# EAGLE design Ver.5 電源 (EAGLE 9.6.2)
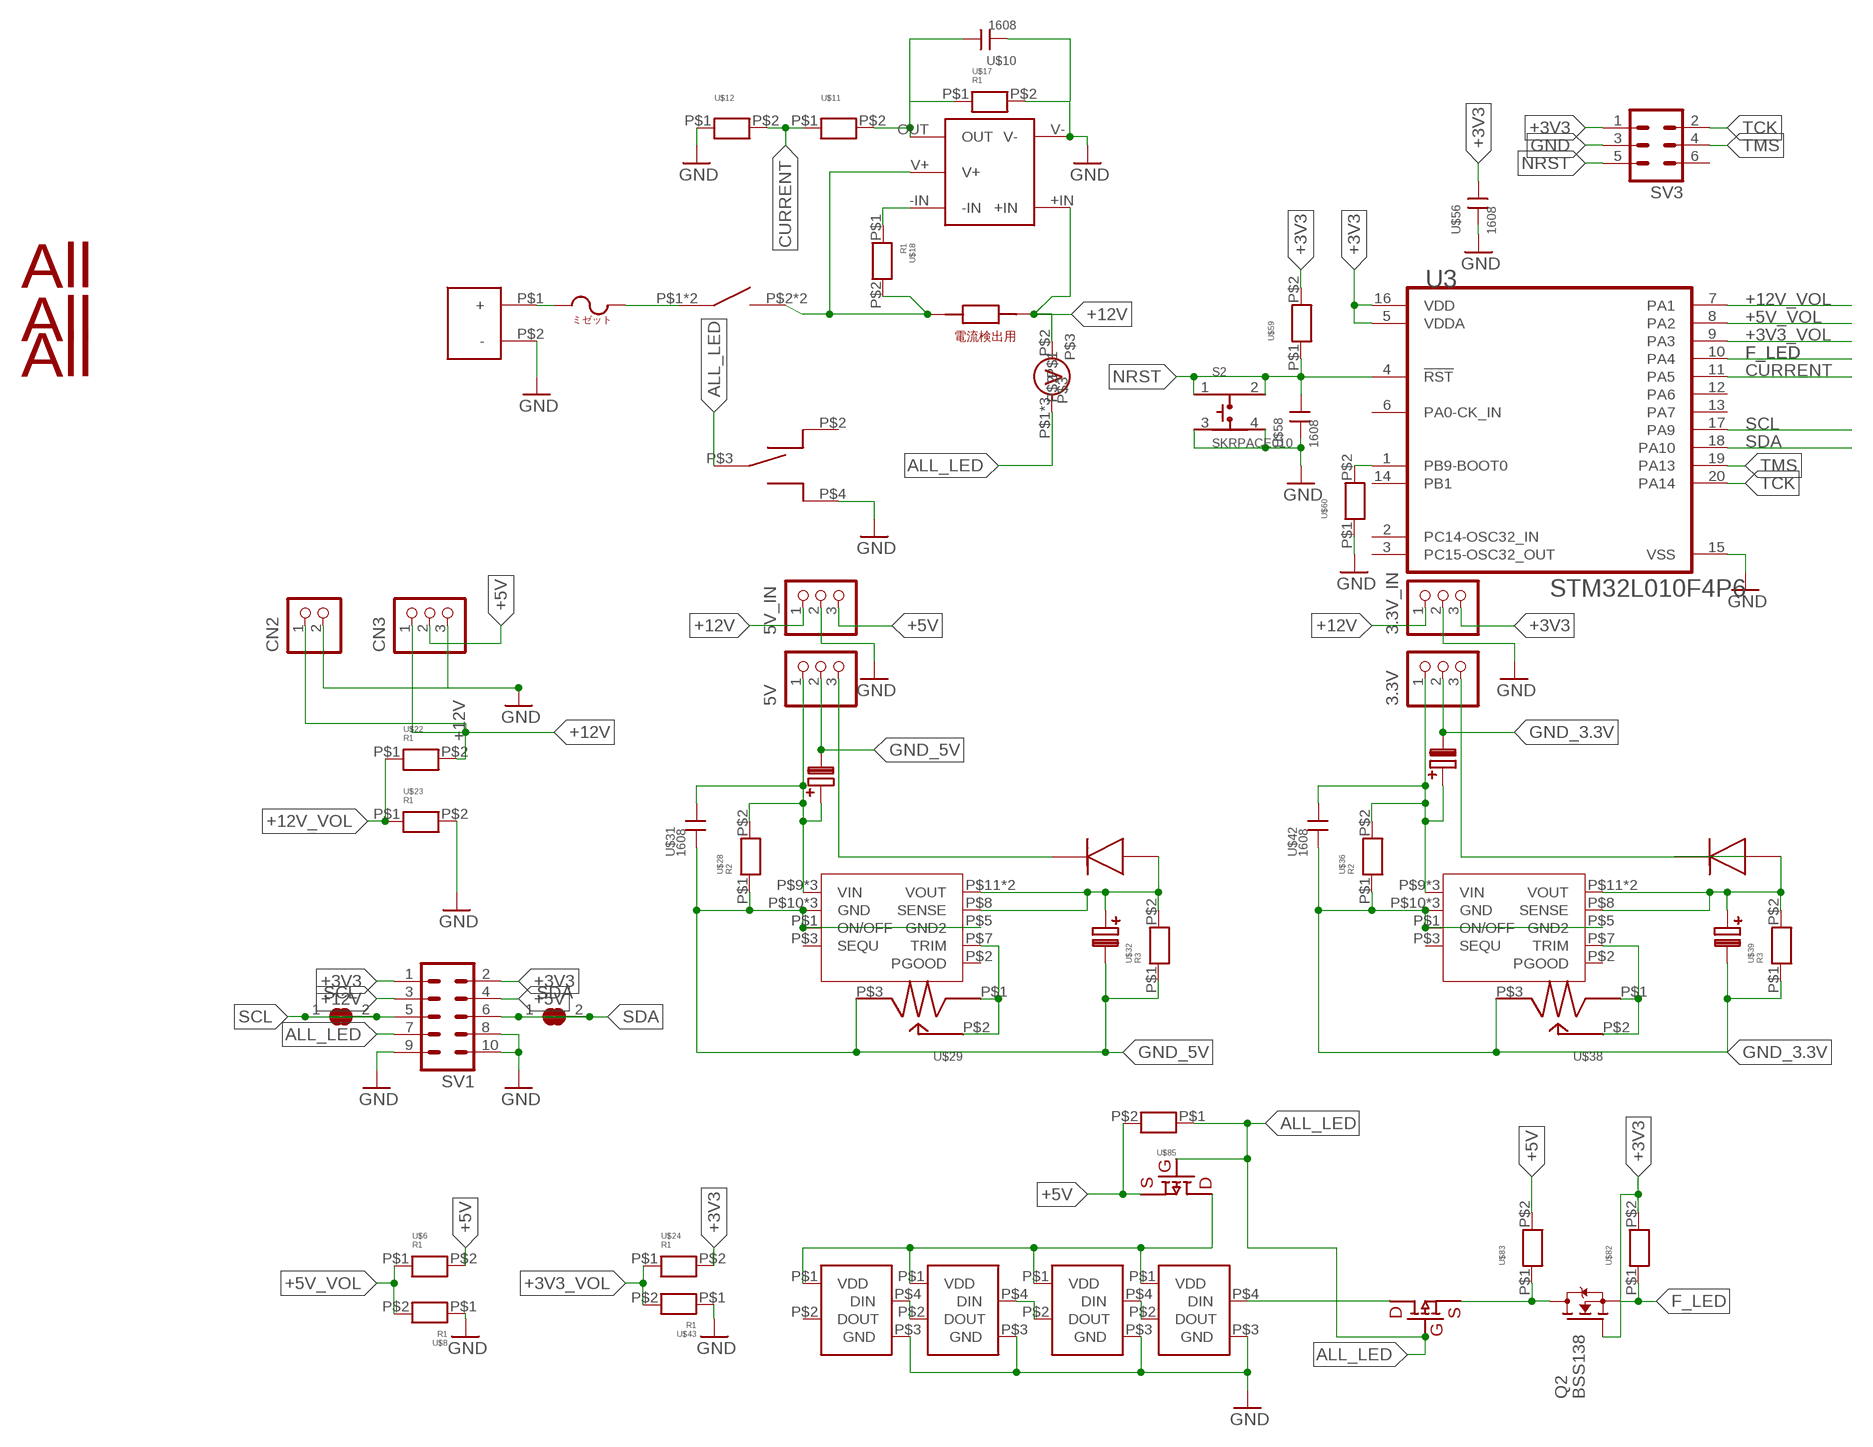
[diagram p0: schematic, sheet 1]

## Parts
3.3V  B3B-XH-A  [B3B-XH-A]
3.3V_IN  B3B-XH-A  [B3B-XH-A]
5V  B3B-XH-A  [B3B-XH-A]
5V_IN  B3B-XH-A  [B3B-XH-A]
CN2  B2B-XH-A  [B2B-XH-A]
CN3  B3B-XH-A  [B3B-XH-A]
F1  LED  [LED]
F2  LED  [LED]
F3  LED  [LED]
F18  LED  [LED]
Q2  BSS138  [SOT23]
S2  SKRPACE010  [SW_SKRPACE010]
SCL  SJ  [SJ]
SDA  SJ  [SJ]
SV1  ML10  [ML10]
SV3  ML6  [ML6]
U3  STMICROELECTRONICS_STM32L010F4P6STMICROELECTRONICS_STM32L010F4P6_0_0  [STMICROELECTRONICS_STM32L010F4P6_0]
U$1  XT60  [XT60]
U$2  MF  [ｍｆ]
U$3  V  [V]
U$4  SW3  [SW3]
U$5  25V100  [25V100]
U$6  R1  R  [1608]
U$7  25V100  [25V100]
U$8  R1  R  [1608]
U$9  ALL  [ALL]
U$10  1608  [CON]
U$11  R  [1608]
U$12  R  [1608]
U$13  LT6106  [LT6106]
U$14  R  [ｒ05]
U$15  ALL  [ALL]
U$16  S  [S]
U$17  R1  R  [1608]
U$18  R1  R  [1608]
U$19  ALL  [ALL]
U$22  R1  R  [1608]
U$23  R1  R  [1608]
U$24  R1  R  [1608]
U$26  DCDC  [DC-DC]
U$28  R2  R  [1608]
U$29  VR  [VR]
U$30  25V100  [25V100]
U$31  1608  [CON]
U$32  R3  R  [1608]
U$33  40V5A  [40V5A]
U$34  DCDC  [DC-DC]
U$36  R2  R  [1608]
U$37  40V5A  [40V5A]
U$38  VR  [VR]
U$39  R3  R  [1608]
U$40  25V100  [25V100]
U$42  1608  [CON]
U$43  R1  R  [1608]
U$56  1608  [CON]
U$58  1608  [CON]
U$59  R  [1608]
U$60  R  [1608]
U$82  R  [1608]
U$83  R  [1608]
U$84  808  [808]
U$85  R  [1608]
U$86  808  [808]

## Nets
+3V3: 3.3V_IN.3 Q2.1(G) SV1.1 SV1.2 SV3.1 U3.5(VDDA) U3.16(VDD) U$24.P$2 U$56.P$1 U$59.P$2 U$82.P$2
+3V3_VOL: U3.9(PA3) U$24.P$1 U$43.P$2
+5V: 5V_IN.3 CN3.2 SV1.4 U$6.P$2 U$83.P$2 U$84.S U$85.P$2
+5V_OFF1: F1.P$1(VDD) F2.P$1(VDD) F3.P$1(VDD) F18.P$1(VDD) U$84.D U$84.DD(D) U$84.DDD(D) U$84.DDDD(D)
+5V_VOL: U3.8(PA2) U$6.P$1 U$8.P$2
+12V: 3.3V_IN.1 5V_IN.1 CN2.1 CN3.1 SV1.3 U$3.P$2 U$13.+IN U$14.P$1 U$22.P$2
+12V_VOL: U3.7(PA1) U$22.P$1 U$23.P$1
ALL_LED: SV1.7 U$3.P$1 U$3.P$4 U$3.P$5 U$16.P$3 U$84.G U$85.P$1 U$86.G
CURRENT: U3.11(PA5) U$11.P$1 U$12.P$2
F_LED: Q2.2(S) U3.10(PA4) U$82.P$1
GND: 3.3V_IN.2 5V_IN.2 CN2.2 CN3.3 F1.P$3(GND) F2.P$3(GND) F3.P$3(GND) F18.P$3(GND) S2.3 S2.4 SV1.8 SV1.9 SV1.10 SV3.3 U3.15(VSS) U$1.P$2(-) U$8.P$1 U$10.P$2 U$12.P$1 U$13.V- U$16.P$4 U$17.P$2 U$23.P$2 U$43.P$1 U$56.P$2 U$58.P$2 U$60.P$1
GND_3.3V: 3.3V.2 U$7.P$2 U$34.P$1(ON/OFF) U$34.P$5(GND2) U$34.P$10(GND) U$34.P$16(GND) U$34.P$17(GND) U$36.P$1 U$38.P$3 U$39.P$1 U$40.P$2 U$42.P$2
GND_5V: 5V.2 U$5.P$2 U$26.P$1(ON/OFF) U$26.P$5(GND2) U$26.P$10(GND) U$26.P$16(GND) U$26.P$17(GND) U$28.P$1 U$29.P$3 U$30.P$2 U$31.P$2 U$32.P$1
N$1: U$10.P$1 U$11.P$2 U$13.OUT U$17.P$1
N$2: F2.P$2(DOUT) F3.P$4(DIN)
N$3: U$1.P$1(+) U$2.P$1 U$2.P$2
N$4: U$2.P$3 U$2.P$4 U$4.P$1 U$4.P$3
N$5: F1.P$2(DOUT) F2.P$4(DIN)
N$6: F1.P$4(DIN) F18.P$2(DOUT)
N$7: 5V.1 U$5.P$1 U$26.P$9(VIN) U$26.P$14(VIN) U$26.P$15(VIN) U$28.P$2 U$31.P$1
N$8: U$13.-IN U$18.P$1
N$9: 3.3V.1 U$7.P$1 U$34.P$9(VIN) U$34.P$14(VIN) U$34.P$15(VIN) U$36.P$2 U$42.P$1
N$10: 5V.3 U$33.P$2
N$11: U$4.P$2 U$4.P$4 U$13.V+ U$14.P$2 U$18.P$2
N$12: 3.3V.3 U$37.P$2
N$13: U3.1(PB9-BOOT0) U$60.P$2
N$15: U$26.P$8(SENSE) U$26.P$11(VOUT) U$26.P$18(VOUT) U$30.P$1 U$32.P$2 U$33.P$1
N$16: U$26.P$7(TRIM) U$29.P$1 U$29.P$2
N$21: U$34.P$8(SENSE) U$34.P$11(VOUT) U$34.P$18(VOUT) U$37.P$1 U$39.P$2 U$40.P$1
N$22: U$34.P$7(TRIM) U$38.P$1 U$38.P$2
N$35: Q2.3(D) U$83.P$1 U$86.S
N$36: F18.P$4(DIN) U$86.D U$86.DD(D) U$86.DDD(D) U$86.DDDD(D)
NRST: S2.1 S2.2 SV3.5 U3.4(!RST!) U$58.P$1 U$59.P$1
SCL: SCL.1 SCL.2 SV1.5 U3.17(PA9)
SDA: SDA.1 SDA.2 SV1.6 U3.18(PA10)
TCK: SV3.2 U3.20(PA14)
TMS: SV3.4 U3.19(PA13)
Unconnected: F3.P$2(DOUT) SV3.6 U3.2(PC14-OSC32_IN) U3.3(PC15-OSC32_OUT) U3.6(PA0-CK_IN) U3.12(PA6) U3.13(PA7) U3.14(PB1) U$3.P$3 U$16.P$2 U$26.P$2(PGOOD) U$26.P$3(SEQU) U$34.P$2(PGOOD) U$34.P$3(SEQU)

## Library data of the parts
3.3V 3.3V_IN 5V 5V_IN CN3 = jst-xh:B3B-XH-A: Wire-to-Board 2.5mm pitch top mount connector Source: http://www.jst-mfg.com/product/pdf/jpn/XH.pdf http://www.jst-mfg.com/product/detail.php?series=277
CN2 = jst-xh:B2B-XH-A: Wire-to-Board 2.5mm pitch top mount connector Source: http://www.jst-mfg.com/product/pdf/jpn/XH.pdf http://www.jst-mfg.com/product/detail.php?series=277
F1-F3 F18 = フルカラーLED:LED
Q2 = bss138_10:BSS138: BSS138 N-Channel Logic Level Enhancement Mode Field Effect Transistor Source: http://www.fairchildsemi.com/datasheets/BS/BSS138.pdf; MF: Fairchild; MPN: BSS138; OC_FARNELL: 9845330; OC_NEWARK: 67R2009
S2 = SKRPACE010:SKRPACE010: Switch Tactile N.O. SPST Button J-Bend 0.05A 16VDC 2.55N SMD Automotive T/R Check prices <https://pricing.snapeda.com/parts/SKRPACE010/ALPS/view-part?ref=eda>; AVAILABILITY: In Stock; DESCRIPTION: Switch Tactile N.O. SPST Button J-Bend 0.05A 16VDC 2.55N SMD Automotive T/R; MF: ALPS; MP: SKRPACE010; PACKAGE: None; PRICE: None
SCL SDA = jumper:SJ: SMD solder JUMPER
SV1 = con-ml:ML10: HARTING; OC_FARNELL: unknown; OC_NEWARK: unknown
SV3 = con-ml:ML6: HARTING; OC_FARNELL: unknown; OC_NEWARK: unknown
U3 = STMicroelectronics - STM32L010F4P6:STMICROELECTRONICS_STM32L010F4P6: ARM® Cortex®-M0+ STM32L0 Microcontroller IC 32-Bit 32MHz 16KB (16K x 8) FLASH 20-TSSOP; AMBIENT_TEMPERATURE_RANGE_HIGH: +85°C; AMBIENT_TEMPERATURE_RANGE_LOW: -40°C; AUTOMOTIVE: No; CENTROID_NOT_SPECIFIED: No; CORE_ARCHITECTURE: Arm Cortex-M0+; DATASHEET: https://www.st.com/resource/en/datasheet/stm32l010f4.pdf; DATA_BUS_WIDTH: 32bits; DEVICE_CLASS_L1: Integrated Circuits (ICs); DEVICE_CLASS_L2: Embedded Processors and Controllers; DEVICE_CLASS_L3: Microcontrollers; DIGIKEY_DESCRIPTION: IC 16/32-BITS MICROS; DIGIKEY_PART_NUMBER: 497-19364-ND; FOOTPRINT_PARAMETERS_1: {"fp_type":"TSSOP2","params":{"N":{"nom":20,"long name":"Number of leads","min":null,"max":null,"short name":"N","type":"count"},"A":{"nom":false,"long name":"Height","min":false,"max":1200000,"short name":"A","type":"measurement"},"A1":{"nom":false,"long name":"Package clearance","min":50000,"max":150000,"short name":"A1","type":"measurement"},"A2":{"nom":1000000,"long name":"Package height","min":800000,"max":1050000,"short name":"A2","type":"measurement"},"D":{"nom":6500000,"long name":"Package length","min":6400000,"max":6600000,"short name":"D","type":"measurement"},"E":{"nom":6400000,"long name":"Width /w leads","min":6200000,"max":6600000,"short name":"E","type":"measurement"},"E1":{"nom":4400000,"long name":"Package width","min":4300000,"max":4500000,"short name":"E1","type":"measurement"},"B":{"nom":false,"long name":"Lead width","min":190000,"max":300000,"short name":"B","type":"measurement"},"C":{"nom":false,"long name":"Lead thickness","min":90000,"max":200000,"short name":"C","type":"measurement"},"L":{"nom":600000,"long name":"Lead foot length","min":450000,"max":750000,"short name":"L","type":"measurement"},"e":{"nom":650000,"long name":"Lead pitch","min":null,"max":null,"short name":"e","type":"measurement"},"PHI":{"nom":false,"long name":"Lead angle","min":0,"max":8000000,"short name":"PHI","type":"measurement"},"HT":{"default":"No","long name":"Thermal pad","type":"multichoiceparent","short name":"HT","children":[]},"offset x":{"nom":0,"long name":"X Center offset","min":null,"max":null,"short name":"offset x","type":"measurement"},"offset y":{"nom":0,"long name":"Y Center offset","min":null,"max":null,"short name":"offset y","type":"measurement"},"LS":{"default":"Rounded rectangle","long name":"Land shape","type":"multichoice","short name":"LS"},"LS1":{"default":"Rectangle","long name":"Land shape (Pin 1)","type":"multichoice","short name":"LS1"},"solder toe":{"nom":550000,"long name":"Solder fillet (toe)","min":null,"max":null,"short name":"solder toe","type":"fixedmeasurement"},"solder heel":{"nom":450000,"long name":"Solder fillet (heel)","min":null,"max":null,"short name":"solder heel","type":"fixedmeasurement"},"solder side":{"nom":50000,"long name":"Solder fillet (side)","min":null,"max":null,"short name":"solder side","type":"fixedmeasurement"},"courtyard":{"nom":500000,"long name":"Courtyard","min":null,"max":null,"short name":"courtyard","type":"fixedmeasurement"},"SF":{"default":"A (> 0.625mm pitch)","long name":"Packing level","type":"multichoiceparent","short name":"SF","help":"http://support.upverter.com/customer/portal/articles/978783-what-is-a-footprint-packing-level","children":["solder toe","solder heel","solder side","courtyard"]}}}; FOOTPRINT_PARAMETERS_2: {"fp_type":"TSSOP2","params":{"N":{"nom":20,"long name":"Number of leads","min":null,"max":null,"short name":"N","type":"count"},"A":{"nom":false,"long name":"Height","min":false,"max":1200000,"short name":"A","type":"measurement"},"A1":{"nom":false,"long name":"Package clearance","min":50000,"max":150000,"short name":"A1","type":"measurement"},"A2":{"nom":1000000,"long name":"Package height","min":800000,"max":1050000,"short name":"A2","type":"measurement"},"D":{"nom":6500000,"long name":"Package length","min":6400000,"max":6600000,"short name":"D","type":"measurement"},"E":{"nom":6400000,"long name":"Width /w leads","min":6200000,"max":6600000,"short name":"E","type":"measurement"},"E1":{"nom":4400000,"long name":"Package width","min":4300000,"max":4500000,"short name":"E1","type":"measurement"},"B":{"nom":false,"long name":"Lead width","min":190000,"max":300000,"short name":"B","type":"measurement"},"C":{"nom":false,"long name":"Lead thickness","min":90000,"max":200000,"short name":"C","type":"measurement"},"L":{"nom":600000,"long name":"Lead foot length","min":450000,"max":750000,"short name":"L","type":"measurement"},"e":{"nom":650000,"long name":"Lead pitch","min":null,"max":null,"short name":"e","type":"measurement"},"PHI":{"nom":false,"long name":"Lead angle","min":0,"max":8000000,"short name":"PHI","type":"measurement"},"HT":{"default":"No","long name":"Thermal pad","type":"multichoiceparent","short name":"HT","children":[]},"offset x":{"nom":0,"long name":"X Center offset","min":null,"max":null,"short name":"offset x","type":"measurement"},"offset y":{"nom":0,"long name":"Y Center offset","min":null,"max":null,"short name":"offset y","type":"measurement"},"LS":{"default":"Rounded rectangle","long name":"Land shape","type":"multichoice","short name":"LS"},"LS1":{"default":"Rectangle","long name":"Land shape (Pin 1)","type":"multichoice","short name":"LS1"},"solder toe":{"nom":350000,"long name":"Solder fillet (toe)","min":null,"max":null,"short name":"solder toe","type":"fixedmeasurement"},"solder heel":{"nom":350000,"long name":"Solder fillet (heel)","min":null,"max":null,"short name":"solder heel","type":"fixedmeasurement"},"solder side":{"nom":30000,"long name":"Solder fillet (side)","min":null,"max":null,"short name":"solder side","type":"fixedmeasurement"},"courtyard":{"nom":250000,"long name":"Courtyard","min":null,"max":null,"short name":"courtyard","type":"fixedmeasurement"},"SF":{"default":"B (> 0.625mm pitch)","long name":"Packing level","type":"multichoiceparent","short name":"SF","help":"http://support.upverter.com/customer/portal/articles/978783-what-is-a-footprint-packing-level","children":["solder toe","solder heel","solder side","courtyard"]}}}; FOOTPRINT_PARAMETERS_3: {"fp_type":"TSSOP2","params":{"N":{"nom":20,"long name":"Number of leads","min":null,"max":null,"short name":"N","type":"count"},"A":{"nom":false,"long name":"Height","min":false,"max":1200000,"short name":"A","type":"measurement"},"A1":{"nom":false,"long name":"Package clearance","min":50000,"max":150000,"short name":"A1","type":"measurement"},"A2":{"nom":1000000,"long name":"Package height","min":800000,"max":1050000,"short name":"A2","type":"measurement"},"D":{"nom":6500000,"long name":"Package length","min":6400000,"max":6600000,"short name":"D","type":"measurement"},"E":{"nom":6400000,"long name":"Width /w leads","min":6200000,"max":6600000,"short name":"E","type":"measurement"},"E1":{"nom":4400000,"long name":"Package width","min":4300000,"max":4500000,"short name":"E1","type":"measurement"},"B":{"nom":false,"long name":"Lead width","min":190000,"max":300000,"short name":"B","type":"measurement"},"C":{"nom":false,"long name":"Lead thickness","min":90000,"max":200000,"short name":"C","type":"measurement"},"L":{"nom":600000,"long name":"Lead foot length","min":450000,"max":750000,"short name":"L","type":"measurement"},"e":{"nom":650000,"long name":"Lead pitch","min":null,"max":null,"short name":"e","type":"measurement"},"PHI":{"nom":false,"long name":"Lead angle","min":0,"max":8000000,"short name":"PHI","type":"measurement"},"HT":{"default":"No","long name":"Thermal pad","type":"multichoiceparent","short name":"HT","children":[]},"offset x":{"nom":0,"long name":"X Center offset","min":null,"max":null,"short name":"offset x","type":"measurement"},"offset y":{"nom":0,"long name":"Y Center offset","min":null,"max":null,"short name":"offset y","type":"measurement"},"LS":{"default":"Rounded rectangle","long name":"Land shape","type":"multichoice","short name":"LS"},"LS1":{"default":"Rectangle","long name":"Land shape (Pin 1)","type":"multichoice","short name":"LS1"},"solder toe":{"nom":150000,"long name":"Solder fillet (toe)","min":null,"max":null,"short name":"solder toe","type":"fixedmeasurement"},"solder heel":{"nom":250000,"long name":"Solder fillet (heel)","min":null,"max":null,"short name":"solder heel","type":"fixedmeasurement"},"solder side":{"nom":10000,"long name":"Solder fillet (side)","min":null,"max":null,"short name":"solder side","type":"fixedmeasurement"},"courtyard":{"nom":100000,"long name":"Courtyard","min":null,"max":null,"short name":"courtyard","type":"fixedmeasurement"},"SF":{"default":"C (> 0.625mm pitch)","long name":"Packing level","type":"multichoiceparent","short name":"SF","help":"http://support.upverter.com/customer/portal/articles/978783-what-is-a-footprint-packing-level","children":["solder toe","solder heel","solder side","courtyard"]}}}; FOOTPRINT_VARIANT_NAME_0: Recommended_Land_Pattern; FOOTPRINT_VARIANT_NAME_1: IPC_A; FOOTPRINT_VARIANT_NAME_2: IPC_B; FOOTPRINT_VARIANT_NAME_3: IPC_C; FREQUENCY: 32MHz; HEIGHT: 1.2mm; INTERFACE: I2C,SPI,UART,USART,SMBus,Other; IPC_LAND_PATTERN_NAME: SOP65P640X120-20; LEAD_FREE: Yes; MAX_JUNCTION_TEMP: +105°C; MAX_SUPPLY_VOLTAGE: 3.6V; MEMORY_SIZE: 16KBytes; MEMORY_TYPE: FLASH; MF: STMicroelectronics; MFG_PACKAGE_IDENT: TSSOP20-YA; MFG_PACKAGE_IDENT_DATE: 0; MFG_PACKAGE_IDENT_REV: 3; MIN_SUPPLY_VOLTAGE: 1.8V; MOUSER_DESCRIPTION: Cortex M0+ 16K TSSOP20 85°C; MOUSER_PART_NUMBER: 511-STM32L010F4P6; MPN: STM32L010F4P6; NUMBER_OF_A/D_CONVERTERS: 1; NUMBER_OF_ADC_CHANNELS: 7; NUMBER_OF_CORES: 1; NUMBER_OF_I/OS: 16; NUMBER_OF_I2C_CHANNELS: 1; NUMBER_OF_SPI_CHANNELS: 1; NUMBER_OF_TIMERS/COUNTERS: 7; NUMBER_OF_UART_CHANNELS: 1; PACKAGE: TSSOP20; PREFIX: U; RAM_SIZE: 2KBytes; ROHS: Yes; STANDOFF_HEIGHT: 0.05mm; TEMPERATURE_RANGE_HIGH: +105°C; TEMPERATURE_RANGE_LOW: -40°C; VERIFICATION_VERSION: 0.0.0.3
U$1 = XT60:XT60
U$2 = ミゼットヒューズ:MF
U$3 = voltmeter:V
U$4 = SW3:SW3
U$5 U$7 U$30 U$40 = 100uF25V 電解:25V100
U$6 U$8 U$11 U$12 U$17 U$18 U$22-U$24 U$28 U$32 U$36 U$39 U$43 U$59 U$60 U$82 U$83 U$85 = R 1608:R
U$9 U$15 U$19 = All_outlook:ALL
U$10 U$31 U$42 U$56 U$58 = con1608:1608
U$13 = LT6106:LT6106
U$14 = R 1W0.1Ω:R
U$16 = トグル:S
U$26 U$34 = OKL:DCDC
U$29 U$38 = VR tippu:VR
U$33 U$37 = D40V5A:40V5A
U$84 U$86 = PchMOSFET SSM6J808R:808

## Board
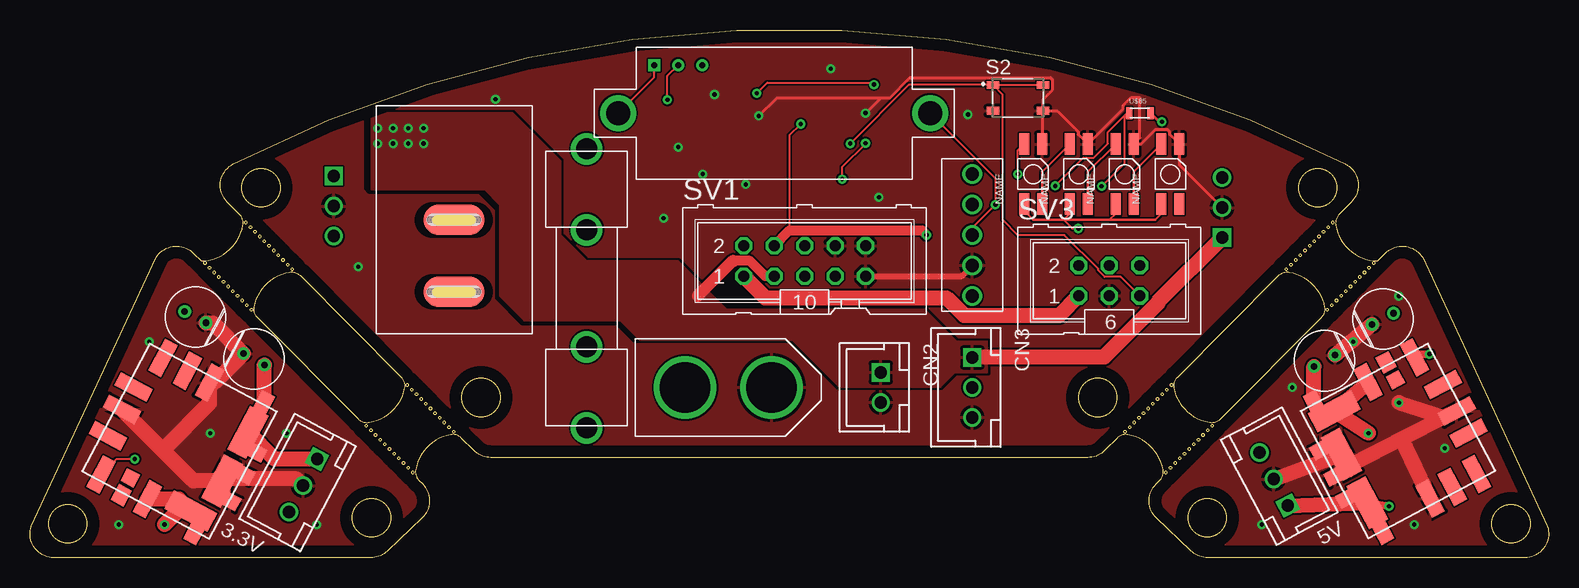
[diagram p1: board, top side]
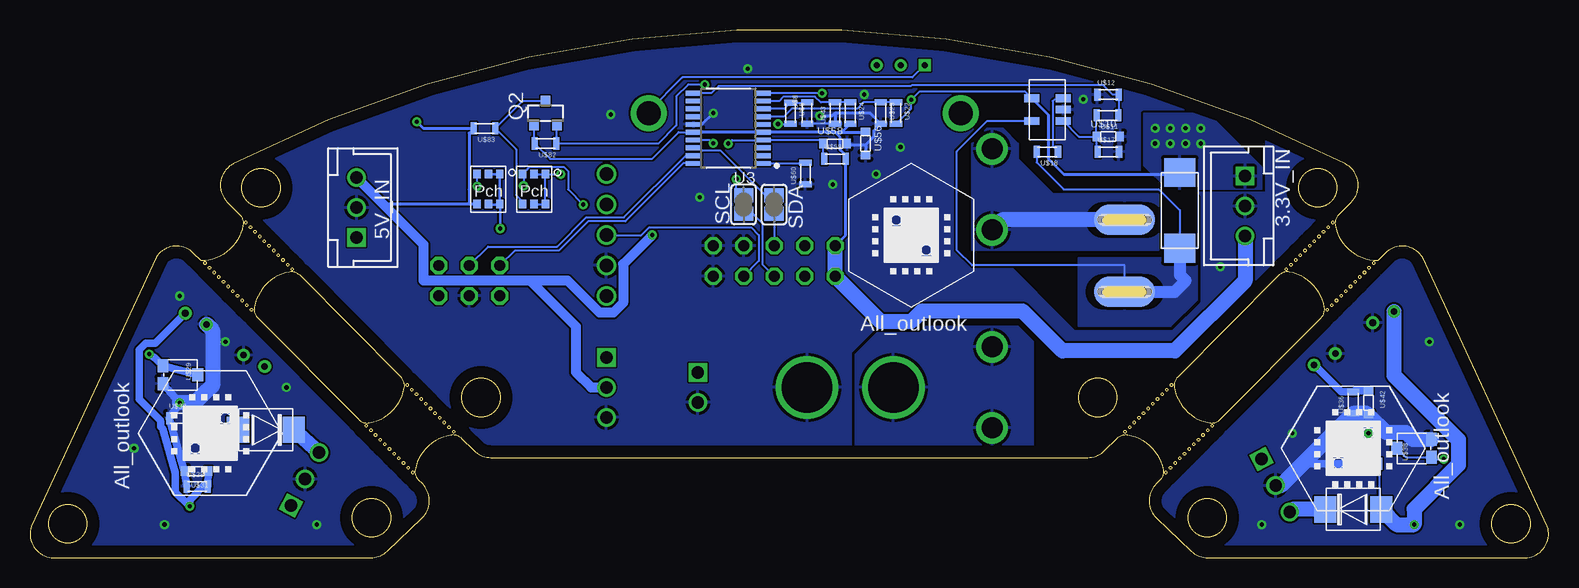
[diagram p2: board, bottom side, seen from below]

Size 126.55 x 43.97 mm. Coordinates in mm from the lower left corner, seen from the top.
Outline: 98.3,11.24 arc-70 95.36,14.15 arc-55 95.63,15.04 104.05,23.52 arc-55 104.93,23.8 arc-70 107.87,20.88 arc-55 107.6,20 99.18,11.52 arc-55 98.3,11.24
Outline: 38.41,8.34 arc-45 36.99,8.93 35.96,9.97 arc55 35.07,10.25 arc70 32.13,7.33 arc55 32.41,6.45 32.71,6.14 arc-90 32.7,3.32 29.78,0.55 arc-43 28.4,0 1.99,0 arc-107 0.1,2.62 10.51,25.02 arc-103 13.62,25.37 14.26,24.73 arc78 17.75,27.7 arc55 17.48,28.59 16.44,29.63 arc-107 16.94,32.81 arc-55 109.61,32.81 arc-107 110.11,29.63 109.08,28.59 arc55 108.81,27.7 arc78 112.3,24.73 112.93,25.37 arc-103 116.05,25.02 126.46,2.62 arc-107 124.57,0 98.15,0 arc-43 96.78,0.55 93.86,3.32 arc-90 93.85,6.14 94.15,6.45 arc55 94.42,7.33 arc70 91.48,10.25 arc55 90.6,9.97 89.57,8.93 arc-45 88.15,8.34 38.41,8.34
Outline: 18.68,20.88 arc-70 21.62,23.8 arc-55 22.51,23.52 30.92,15.04 arc-55 31.2,14.15 arc-70 28.26,11.24 arc-55 27.38,11.52 18.96,20 arc-55 18.68,20.88
Outline: circle at 92.8,12.04 radius 0.1
Outline: circle at 98.14,10.61 radius 0.1
Outline: circle at 95.04,7.49 radius 0.1
Outline: circle at 93.19,12.43 radius 0.1
Outline: circle at 97.75,10.22 radius 0.1
Outline: circle at 105.08,24.42 radius 0.1
Outline: circle at 108.49,21.04 radius 0.1
Outline: circle at 111.59,24.16 radius 0.1
Outline: circle at 106.25,25.59 radius 0.1
Outline: circle at 96.59,9.05 radius 0.1
Outline: circle at 95.82,8.27 radius 0.1
Outline: circle at 104.7,24.03 radius 0.1
Outline: circle at 107.8,27.15 radius 0.1
Outline: circle at 107.3,30.82 radius 1.6
Outline: circle at 108.57,27.93 radius 0.1
Outline: circle at 93.96,13.21 radius 0.1
Outline: circle at 98.09,3.34 radius 1.6
Outline: circle at 94.65,7.1 radius 0.1
Outline: circle at 108.18,27.54 radius 0.1
Outline: circle at 88.97,13.34 radius 1.6
Copper layers (1*16): Top 0.035mm / dielectric 1.5mm / Bottom 0.035mm
Design rules "default": minimum track width 6mil, minimum drill 0.35mm, track to track 6mil, track to pad 6mil, pad to pad 6mil, via to via 6mil, smd to smd 6mil, copper to edge 40mil, drill to drill 6mil, minimum pad ring 10mil, minimum via ring 8mil, stop-mask expansion 4mil, vias tented up to drill 0mil, thermal gap 10mil
Holes 0.9 mm at 33.8,22.15 36.86,22.15 35.07,22.15 36.34,22.15 33.93,22.15 34.05,22.15 34.18,22.15 34.31,22.15 34.44,22.15 34.56,22.15 34.56,22.15 34.69,22.15 34.82,22.15 34.94,22.15 35.2,22.15 35.32,22.15 35.45,22.15 35.58,22.15 35.71,22.15 36.86,22.15 36.73,22.15 36.61,22.15 36.48,22.15 36.23,22.15 36.1,22.15 35.97,22.15 35.85,22.15 35.85,22.15 33.67,22.15 33.55,22.15 36.99,22.15 37.12,22.15 33.8,28.14 36.86,28.14 35.07,28.14 36.34,28.14 33.93,28.14 34.05,28.14 34.18,28.14 34.31,28.14 34.44,28.14 34.56,28.14 34.56,28.14 34.69,28.14 34.82,28.14 34.94,28.14 35.2,28.14 35.32,28.14 35.45,28.14 35.58,28.14 35.71,28.14 36.86,28.14 36.73,28.14 36.61,28.14 36.48,28.14 36.23,28.14 36.1,28.14 35.97,28.14 35.85,28.14 35.85,28.14 33.67,28.14 33.55,28.14 36.99,28.14 37.12,28.14

### Footprints (pad centres in the part's own frame; a part is rotated, then mirrored left to right if it is on the bottom)
B3B-XH-A = drill 1.016 square: 1 -2.5,0 | drill 1.016: 2 0,0; 3 2.5,0
B2B-XH-A = drill 1.016 square: 1 -1.25,0 | drill 1.016: 2 1.25,0
LED = smd 1.8 x 0.82: P$1 -2.5,0.75; P$2 -2.5,-0.75; P$3 2.5,-0.75; P$4 2.5,0.75
SOT23 = smd 0.8 x 0.9: 1 -0.95,-1; 2 0.95,-1; 3 0,1
SW_SKRPACE010 = smd 1.05 x 0.65: 1 -2.075,1.075; 2 2.075,1.075; 3 -2.075,-1.075; 4 2.075,-1.075
SJ = smd 1.168 x 1.6: 1 -0.762,0; 2 0.762,0
ML10 = drill 0.914 octagon: 1 -5.08,-1.27; 2 -5.08,1.27; 3 -2.54,-1.27; 4 -2.54,1.27; 5 0,-1.27; 6 0,1.27; 7 2.54,-1.27; 8 2.54,1.27; 9 5.08,-1.27; 10 5.08,1.27
ML6 = drill 0.914 octagon: 1 -2.54,-1.27; 2 -2.54,1.27; 3 0,-1.27; 4 0,1.27; 5 2.54,-1.27; 6 2.54,1.27
STMICROELECTRONICS_STM32L010F4P6_0 = smd 1.35 x 0.4: 1 -2.875,2.925; 2 -2.875,2.275; 3 -2.875,1.625; 4 -2.875,0.975; 5 -2.875,0.325; 6 -2.875,-0.325; 7 -2.875,-0.975; 8 -2.875,-1.625; 9 -2.875,-2.275; 10 -2.875,-2.925; 11 2.875,-2.925; 12 2.875,-2.275; 13 2.875,-1.625; 14 2.875,-0.975; 15 2.875,-0.325; 16 2.875,0.325; 17 2.875,0.975; 18 2.875,1.625; 19 2.875,2.275; 20 2.875,2.925
XT60 = drill 4.2: P$1 -3.6,0; P$2 3.6,0
ｍｆ = drill 1.75: P$1 -6.55,0; P$2 0.2,0; P$3 9.96,0; P$4 16.71,0
V = drill 0.5 square: P$1 10,-4 | drill 0.5: P$2 8,-4; P$3 6,-4 | drill 2: P$4 -13,0; P$5 13,0
SW3 = smd 2.54 x 5.08: P$1 0,0; P$2 -6,0 | smd 2.54 x 5.08 bottom: P$3 0,0; P$4 -6,0
25V100 = drill 0.55: P$1 -1,0; P$2 1,0
1608 = smd 0.508 x 1.016: P$1 -0.889,0; P$2 0.889,0
CON = smd 0.6 x 0.813: P$1 -1,0; P$2 1,0
LT6106 = smd 0.635 x 1.27: +IN 0.95,1.31; -IN 0.95,-1.31; OUT -0.95,-1.31; V+ -0.95,1.31; V- 0,-1.31
ｒ05 = smd 2.4 x 2.6: P$1 0,1.55; P$2 6.3,1.55
S = drill 1.1: P$1 0,-5.08; P$2 0,-2.54; P$3 0,0; P$4 0,2.54; P$5 0,5.08
DC-DC = smd 3 x 1.2: P$1 -5.5,-0.1; P$2 -5.5,-2.19; P$3 -5.5,-4.48; P$7 5.5,-4.48; P$8 5.5,-0.1 | smd 1.2 x 3: P$4 -2.19,-5.5; P$5 -0.1,-5.5; P$6 2.39,-5.5 | smd 4.07 x 1.77: P$9 -3.335,4.685; P$10 1.245,4.685 | smd 1.77 x 4.07: P$11 4.685,3.535 | smd 1.5 x 1.2: P$12 6.25,-2.19 | smd 1.2 x 1.2: P$13 4.6,-2.19 | smd 1.63 x 1.2: P$14 -6.2,4.685; P$18 6.2,4.68 | smd 1.2 x 1.63: P$15 -2.19,6; P$16 -0.1,6; P$17 2.39,6
VR = smd 1.1 x 0.9: P$1 0,1.45; P$2 -0.75,-1.45; P$3 0.75,-1.45
40V5A = smd 1.85 x 2.2: P$1 -2.325,0; P$2 2.325,0
808 = smd 0.62 x 0.7: D 0,0; DD 0.95,0; DDD 0.95,2.5; DDDD 0,2.5; G 1.9,0; S 1.9,2.5

### Placement (x,y rotation side)
3.3V  22.75,6.01 242 top
3.3V_IN  25.3,29.3 270 bottom
5V  103.64,6.55 118 top
5V_IN  99.35,29.17 90 bottom
CN2  70.9,14.19 270 top
CN3  78.52,14.19 270 top
F1  87.41,31.97 90 top
F2  91.22,31.97 90 top
F3  95.03,31.97 90 top
F18  83.6,31.97 90 top
Q2  83.6,37.05 0 bottom
S2  82.33,38.32 0 top
SCL  67.09,29.43 90 bottom
SDA  64.55,29.43 270 bottom
SV1  64.55,24.73 0 top
SV3  89.95,23.08 0 top
U3  68.36,35.78 180 bottom
U$1  58.2,14.19 0 top
U$2  46.39,17.36 90 top
U$3  62.01,37.05 180 top
U$4  35.34,28.16 90 top
U$5  112.73,19.9 208 top
U$6  63.18,37.03 270 bottom
U$7  18.66,16.54 152 top
U$8  61.79,37.05 90 bottom
U$9  53.12,26.89 0 bottom
U$10  36.7,35.09 0 bottom
U$11  36.76,36.86 180 bottom
U$12  36.71,38.58 0 bottom
U$13  41.76,37.34 90 bottom
U$14  32.29,32.09 270 bottom
U$15  16.29,9.11 90 bottom
U$16  78.52,26.89 180 top
U$17  36.7,33.82 0 bottom
U$18  41.78,33.82 180 bottom
U$19  111.54,10.38 270 bottom
U$22  54.39,37.05 270 bottom
U$23  55.66,37.05 270 bottom
U$24  58.2,37.05 270 bottom
U$26  114,9.72 118 top
U$28  112.62,5.93 0 bottom
U$29  114.03,15.24 270 bottom
U$30  107.88,16.41 28 top
U$31  112.68,7.21 180 bottom
U$32  114.08,11.62 0 bottom
U$33  106.89,10.66 0 bottom
U$34  12.46,9.69 242 top
U$36  16.29,12.92 90 bottom
U$37  16.29,4.03 180 bottom
U$38  11.21,9.11 90 bottom
U$39  15.02,7.84 0 bottom
U$40  13.77,20.04 332 top
U$42  15.02,12.92 270 bottom
U$43  59.47,37.05 90 bottom
U$56  56.93,34.51 270 bottom
U$58  59.47,34.51 0 bottom
U$59  59.47,33.24 0 bottom
U$60  61.93,32 90 bottom
U$82  83.6,34.51 180 bottom
U$83  88.68,35.78 180 bottom
U$84  87.41,31.97 180 bottom
U$85  92.49,37.05 0 top
U$86  83.6,31.97 180 bottom

### Tracks (layer width: path | path; a pad name or v marks a point on that pad's centre or on a via)
+3V3
  Top 1.27: SV1.1 61.27,21.65 76.39,21.65 77.85,20.19 85.8,20.19 SV3.1
  Bottom 0.152: 58.9,35.45 58.91,35.44 56.99,35.44 U$56.P$1 | Q2.1 84.55,34.57 U$82.P$2 83.22,33.24 74.71,33.24 72.49,35.45 U3.16
  Bottom 0.254: SV1.2 58.58,26.89 U$59.P$2 58.58,33.52 59.05,33.98 59.05,35.03 59.47,35.45 | 59.47,35.45 U3.5 U3.16 | U$56.P$1 56.98,35.46 59.46,35.46 59.47,35.45 | 59.47,35.45 58.9,35.45 U$24.P$2
  Bottom 1.27: 3.3V_IN.3 25.3,23.07 31.15,17.22 40.52,17.22 43.83,20.54 52.24,20.54 53.12,19.66 55.67,19.66 SV1.1 SV1.2
+3V3_VOL
  Bottom 0.152: U$24.P$1 U$43.P$2 60.66,37.94 61.14,38.42 63.77,38.42 64.13,38.05 U3.9
+5V  (via drill 0.35)
  Top 0.152: v64.22,36.14 63.28,35.19 63.28,27.27
  Top 0.254: U$85.P$2 94.09,36.33 v94.33,36.33
  Top 0.813: v74.71,26.89 74.33,27.27 63.28,27.27 SV1.4
  Bottom 0.152: v64.22,36.14 U$6.P$2
  Bottom 0.254: U$84.S 89.95,29.47 | 89.95,29.47 97.14,29.47 5V_IN.3 | 89.95,29.47 89.95,30.67 89.96,30.68 89.96,35.39 U$83.P$2 93.78,35.78 v94.33,36.33
  Bottom 0.813: v74.71,26.89 77.13,24.46 77.13,21.23 77.94,20.42 79.09,20.42 81.74,23.08 84.87,23.08 | 84.87,23.08 93.76,23.08 93.76,26.08 5V_IN.3 | 84.87,23.08 81.06,19.27 81.06,15.46 79.79,14.19 CN3.2
+5V_OFF1  (via drill 0.35)
  Top 0.203: F18.P$1 82.85,28.91 83.6,28.16 86.14,28.16 | 89.95,28.16 86.14,28.16 | 89.95,28.16 93.76,28.16 94.28,28.68 F3.P$1 | F2.P$1 90.47,28.68 89.95,28.16 | F1.P$1 86.66,28.68 86.14,28.16 | 86.14,28.16 86.86,27.43 v87.37,27.43
  Bottom 0.203: v87.37,27.43 87.37,29.43 | 87.37,29.43 U$84.DDDD U$84.D U$84.DD | U$84.DDD 88.32,29.43 87.37,29.43
+5V_VOL
  Bottom 0.152: U$8.P$2 61.8,37.92 U$6.P$1 63.7,37.4 U3.8
+12V  (via drill 0.35)
  Top 0.152: v53.12,38.17 53.12,40.16 U$3.P$2
  Top 0.813: 58.61,24.73 59.99,24.73 61.26,23.46 SV1.3
  Top 1.016: 58.61,24.73 58.58,24.73 55.66,21.81
  Top 1.27: CN3.1 78.56,16.73 89.53,16.73 93.99,21.19 93.99,21.31 5V_IN.1
  Bottom 0.152: U$22.P$2 53.12,37.43 v53.12,38.17 52.42,38.86 43.65,38.86 U$13.+IN
  Bottom 0.254: U$13.+IN 41.69,36.9 41.69,33.24 40.42,31.97 30.87,31.97 U$14.P$1
  other vias: 30.26,35.78 31.53,35.78 32.8,35.78 32.8,34.51 31.53,34.51 30.26,34.51 28.99,34.51 28.99,35.78
  pour Top: 28.44,37.03 28.44,30.7 37.88,30.7 39.15,29.43 39.15,21.81 41.18,19.77 49.21,19.77 50.81,18.17 63.52,18.17 67.46,14.24 75.86,14.24 77.08,15.46 79.79,15.46 79.79,18 77.25,18 74.58,20.66 58.07,20.66 54.02,24.71 46.4,24.71 44.23,26.89 44.23,33.03 40.23,37.03
  pour Bottom: 23.91,30.7 31.71,30.7 33.72,32.72 33.72,37.02 28.4,37.02 23.91,32.52
+12V_VOL
  Bottom 0.152: U$22.P$1 U$23.P$1 57.11,37.94 57.63,37.42 63.09,37.42 63.76,36.75 U3.7
ALL_LED  (via drill 0.35)
  Top 0.152: v89.3,30.95 91.22,32.87 91.22,36.67 U$85.P$1 91.41,37.05 89.83,35.46 89.83,34.5 88.66,33.34 87.79,33.34 v85.43,30.98 | U$16.P$3 78.52,27.49 v80.45,29.43 80.45,31.6 U$3.P$4 | U$3.P$5 52.01,40.05 U$3.P$1
  Bottom 0.152: v85.43,30.98 85.43,31.9 U$86.G 85.09,32.38 85.09,32.41 84.92,32.57 82.08,32.57 81.72,32.22 81.72,30.7 v80.45,29.43 | U$84.G 89.31,30.96 v89.3,30.95 | U$3.P$1 53.02,40.03 72.19,40.03 75.01,37.21 U$3.P$4 | U$16.P$3 75.61,26.89 74.97,27.52 66.45,27.52 65.82,26.89 65.82,24.73 SV1.7
CURRENT
  Bottom 0.152: U$11.P$1 35.82,36.91 U$12.P$2 36.34,38.58 37.11,39.36 53.1,39.36 53.16,39.3 69.18,39.3 69.77,38.7 U3.11
F_LED  (via drill 0.35)
  Top 0.152: v60.55,38.69 61.45,39.59 70.17,39.59 v70.33,39.43
  Bottom 0.152: Q2.2 82.65,34.57 U$82.P$1 74.21,34.51 72.69,36.03 72.69,38.44 71.71,39.43 v70.33,39.43 | U3.10 65.18,38.7 65.16,38.72 60.58,38.72 v60.55,38.69
GND  (via drill 0.35)
  Top 0.254: F18.P$3 84.4,34.52 S2.4 | S2.4 85.59,37.24 87.35,35.48 87.35,35.28 F1.P$3 91.07,37.37 91.07,37.67 91.71,38.32 92.49,38.32 92.49,34.99 F2.P$3 92.57,34.47 93.75,35.65 94.8,35.65 94.97,35.48 94.97,35.28 F3.P$3 95.78,32.74 5V_IN.2 | v69.63,37.05 70.88,38.3 | S2.4 84.4,38.15 85.21,38.95 85.21,39.83 85.04,40 73.33,40 71.63,38.3 70.88,38.3 | 70.88,38.3 62.23,38.3 v60.74,36.81
  Top 0.508: SV1.9 77.63,23.46 U$16.P$4
  Bottom 0.152: U$43.P$1 U$8.P$1
  Bottom 0.254: U3.15 70.57,36.1 v69.63,37.05 | 59.47,37.05 56.55,37.05 U$23.P$2 56.24,35.57 56.24,35.09 56.93,34.4 | 59.47,37.05 U$43.P$1 | 56.93,34.4 U$56.P$2 | U$58.P$2 58.37,34.4 56.93,34.4 | v60.74,36.81 59.7,36.81 59.47,37.05
  other vias: 38.79,38.2 27.36,24.23 78.16,36.93 66.73,40.74 57.04,38.6 54.02,34.21 56.05,31.97 59.66,31.1 52.8,28.28 70.74,30.04
  pour Bottom: 58.16,20.24 58.16,9.11 87.41,9.11 101.38,23.08 101.38,30.7 99.42,30.7 95.03,26.3 95.03,21.81 92.49,19.27 77.25,19.27 75.98,20.54 75.98,23.08 72.17,26.89 66.68,26.89 66.15,26.35 66.15,25.35 66.96,24.54 68.23,24.54 68.36,24.41 68.36,22.61 66,20.24
  pour Top: 27.72,37.05 27.72,30.7 28.16,30.25 37.34,30.25 38.63,28.97 38.63,21.58 40.91,19.29 48.81,19.29 50.27,17.83 63.33,17.83 67.24,13.92 76.08,13.92 77.29,15.13 79.99,15.13 80.16,15.29 80.16,15.9 89.78,15.9 99.54,25.65 100.2,25.65 100.41,25.87 100.41,27.57 100.3,27.69 98.28,27.69 98.28,26.73 89.11,17.56 80.13,17.56 80.13,18.33 77.4,18.33 74.76,20.97 58.24,20.97 54.18,25.02 46.55,25.02 44.56,27.01 44.56,33.2 40.4,37.35 28.16,37.35 28.16,39.21 41.53,42.75 57.81,44.75 72.41,44.92 90.19,41.45 99.25,38.47 112.17,32.73 110.83,29.26 88.78,7.2 38.55,7.2 15.31,30.44 15.31,37.78 26.98,37.78
  pour Bottom: 19.82,38.32 23.91,38.32 23.56,37.97 23.56,30.44 23.6,30.4 29.18,30.4 28.96,30.19 28.96,21.26 31.36,18.86 39.48,18.86 45.8,25.18 48.09,25.18 48.55,25.64 48.55,34.63 47.07,36.11 45.28,36.11 40.25,31.08 34.02,31.08 34.02,37.19 33.83,37.38 29.48,37.38 28.38,38.48 28.38,39.46 36.3,47.38 99.36,47.38 112.35,34.39 112.35,31.84 87.8,7.29 59.44,7.29 58.12,8.61 58.12,17.12 55.49,19.75 44.19,19.75 42.61,18.17 42.61,7.79 37.85,7.79 13.57,32.07
GND_3.3V  (via drill 0.35)
  Top 0.152: U$34.P$17 16.64,6.12 16.19,6.57 | U$34.P$10 16.59,6.96 U$34.P$16
  Top 1.27: 3.3V.2 22.19,6.57 16.19,6.57 U$34.P$10 13.62,6.39 11.06,8.96 | 11.06,8.96 U$34.P$5 | 11.06,8.96 14.96,12.86 U$34.P$1 15.37,14.59 U$7.P$2 15.21,19.57 U$40.P$2
  Bottom 0.61: U$39.P$1 20.92,7.84 3.3V.2
  Bottom 1.27: U$38.P$3 11.29,9.86 11.88,10.44 13.54,10.44 U$42.P$2 15.13,12.03 U$36.P$1 22.31,6.01 3.3V.2
  other vias: 7.4,2.76 15.02,10.38 21.37,10.38 23.91,2.76 9.94,18
  pour Top: 9.94,26.89 -1.49,15.46 -1.49,0.22 -0.22,-1.05 32.8,-1.05 35.34,1.49 35.34,6.57 15.02,26.89
  pour Bottom: 8.67,25.62 -2.76,14.19 -2.76,0.22 -1.49,-1.05 31.53,-1.05 35.34,2.76 35.34,5.3 13.75,26.89 12.48,26.89 9.94,26.89
GND_5V  (via drill 0.35)
  Top 0.152: U$26.P$17 108.89,9.02 U$26.P$10 109.28,7.35 U$26.P$16
  Top 1.27: 5V.2 U$26.P$10 110.27,7.84 114.32,9.89 | U$26.P$5 117.87,11.69 | 117.87,11.69 114.32,9.89 | U$26.P$1 114.32,9.89 | U$30.P$2 U$5.P$2 | v114.08,12.92 117.87,11.69
  Bottom 0.61: U$29.P$3 v114.08,12.92 U$32.P$1 U$31.P$2 U$28.P$1
  Bottom 1.27: U$5.P$2 111.82,19.43 111.34,18.95 111.34,14.36 111.8,13.9 111.82,13.9 112.81,12.92 113.08,12.92 113.25,12.94 113.28,12.92 v114.08,12.92
  other vias: 115.35,2.76 102.65,2.76 105.19,14.19 110.27,18 114.08,21.81 117.89,9.11
  pour Top: 115.35,26.89 114.08,26.89 92.49,5.3 92.49,4.03 97.57,-1.05 126.78,-1.05 128.05,0.22 128.05,23.08 124.24,26.89
  pour Bottom: 115.35,28.16 93.76,6.57 93.76,2.76 96.3,0.22 98.84,0.22 126.78,0.22 126.78,16.73
N$1
  Bottom 0.152: U$13.OUT 39.16,35.09 U$10.P$1 | U$10.P$1 37.7,36.81 U$11.P$2 | U$10.P$1 37.7,33.93 U$17.P$1
N$2
  Top 0.203: F2.P$2 91.97,32.16 F3.P$4
N$3
  pour Bottom: 44.23,19.27 42.96,18 42.96,9.11 57.77,9.11 57.78,9.09 57.78,16.92 55.94,18.76 52.36,18.76 51.85,19.27
N$4  (1 unrouted)
  Bottom 1.27: U$4.P$1 45.55,28.16 U$2.P$3
  pour Bottom: 32.54,30.32 32.54,25.62 48.04,25.62 48.04,34.51 46.77,35.78 45.5,35.78 44.23,34.51 44.23,33.24 41.31,30.32
N$5
  Top 0.203: F1.P$2 88.16,32.16 F2.P$4
N$6
  Top 0.203: F18.P$2 84.35,32.16 F1.P$4
N$7  (via drill 0.35)
  Top 0.152: U$26.P$15 110.13,4.58 U$26.P$9 112.78,3.24 U$26.P$14
  Top 0.61: v113.25,4.29 U$26.P$9
  Top 1.27: 5V.1 U$26.P$9
  Bottom 0.61: U$31.P$1 U$28.P$2 112.16,5.93 112.79,5.3 112.79,5.23 113.25,4.78 v113.25,4.29 113.93,4.97 113.95,4.97 114.44,5.45 114.44,7.09 115.51,10.75 115.68,10.92 115.68,11.28 115.71,11.44 117.45,13.19 117.45,17.31 116.91,17.85 116.13,17.85 U$5.P$1
N$8
  Bottom 0.152: U$13.-IN 40.57,38.18 41.2,38.18 41.33,38.04 41.33,34.26 U$18.P$1
N$9
  Top 0.152: U$34.P$15 18.79,9.81 U$34.P$9 18.17,11.62 U$34.P$14
  Top 1.27: U$34.P$14 19.51,16.03 U$7.P$1 | 3.3V.1 20.39,8.22 U$34.P$9
  Bottom 0.61: U$42.P$1 16.18,13.92 U$36.P$2 17.28,13.81 U$7.P$1
N$10
  Bottom 1.27: 5V.3 U$33.P$2
N$11  (1 unrouted)
  Bottom 0.152: 35.34,23.08 35.34,24.35 48.04,24.35 49.31,25.62 49.31,33.85 46.77,36.39 U$13.V+ | U$18.P$2 42.67,32.94 40.42,30.7 32.48,30.7 30.74,28.96 U$14.P$2
  Bottom 0.254: U$4.P$2 35.34,23.08
  Bottom 1.016: U$4.P$2 31.18,22.16 30.26,23.08 30.74,23.56 U$14.P$2
  pour Bottom: 29.34,27.09 29.34,21.45 31.53,19.27 39.15,19.27 39.15,25.01 32.15,25.01 32.15,27.09
N$12
  Bottom 1.27: U$37.P$2 21.35,4.03 3.3V.3
N$13
  Bottom 0.152: U3.1 61.97,32.85 U$60.P$2
N$15  (via drill 0.35)
  Top 0.152: U$26.P$11 107.76,12.2 U$26.P$18
  Top 1.27: v111.54,10.38 U$26.P$11 U$26.P$8 | U$26.P$18 U$30.P$1
  Bottom 0.61: U$32.P$2 112.96,11.8 v111.54,10.38
  Bottom 1.27: U$33.P$1 v111.54,10.38
N$16  (via drill 0.35)
  Top 0.61: v116.62,16.97 115.63,16.93 U$26.P$7
  Bottom 0.61: v116.62,16.97 116.16,16.67 U$29.P$2 U$29.P$1
N$21  (via drill 0.35)
  Top 0.152: U$34.P$18 13.69,3.59 U$34.P$11
  Top 1.27: v11.21,2.76 12.35,3.89 U$34.P$11 12.4,4.88 U$34.P$8
  Bottom 0.152: U$39.P$2 14.13,4.19 U$37.P$1
  Bottom 1.27: U$37.P$1 12.69,2.76 v11.21,2.76 11.21,4.04 7.52,7.72 7.52,9.83 12.89,15.2 U$40.P$1
N$22  (via drill 0.35)
  Top 0.152: U$34.P$7 7.21,8.22 v8.73,8.22
  Bottom 0.152: U$38.P$1 11.91,8.36 U$38.P$2 9.62,8.22 v8.73,8.22
N$35
  Bottom 0.152: Q2.3 85.52,38.05 U$83.P$1 86.04,34.02 86.04,30.2 85.5,29.66 U$86.S
N$36  (via drill 0.35)
  Top 0.152: v82.33,31.97 82.33,33.95 F18.P$4
  Bottom 0.152: U$86.D U$86.DDDD U$86.DDD | U$86.DD U$86.D | U$86.D v82.33,31.97
NRST  (via drill 0.35)
  Top 0.152: SV3.5 90.89,23.41 89.56,23.41 89.01,23.96 89.01,24.08 86.2,26.89 82.33,26.89 81.06,28.16 81.06,38.59 S2.1 | S2.1 S2.2 | S2.1 73.24,39.39 v68.36,34.51
  Bottom 0.152: U$59.P$1 60.47,33.35 U$58.P$1 60.76,34.8 U3.4 68.06,34.8 v68.36,34.51
SCL  (via drill 0.35)
  Top 0.152: v67.68,31.55 67.68,32.56 69.63,34.51 v69.63,34.54
  Bottom 0.152: SV1.5 65.49,24.4 65.49,27.83 66.33,28.66 SCL.1 SCL.2 67.6,30.7 67.68,30.7 v67.68,31.55 | v69.63,34.54 69.89,34.8 U3.17
SDA
  Bottom 0.152: SV1.6 SDA.2 SDA.1 65.3,30.19 69.05,33.93 70.68,33.93 70.9,34.15 U3.18
TCK
  Bottom 0.152: SV3.2 86.14,25.62 82.45,25.62 80.04,28.03 76.94,28.03 72.12,32.85 U3.20
TMS
  Bottom 0.152: SV3.4 88.37,25.92 82.62,25.92 80.2,28.35 77.06,28.35 71.9,33.5 U3.19